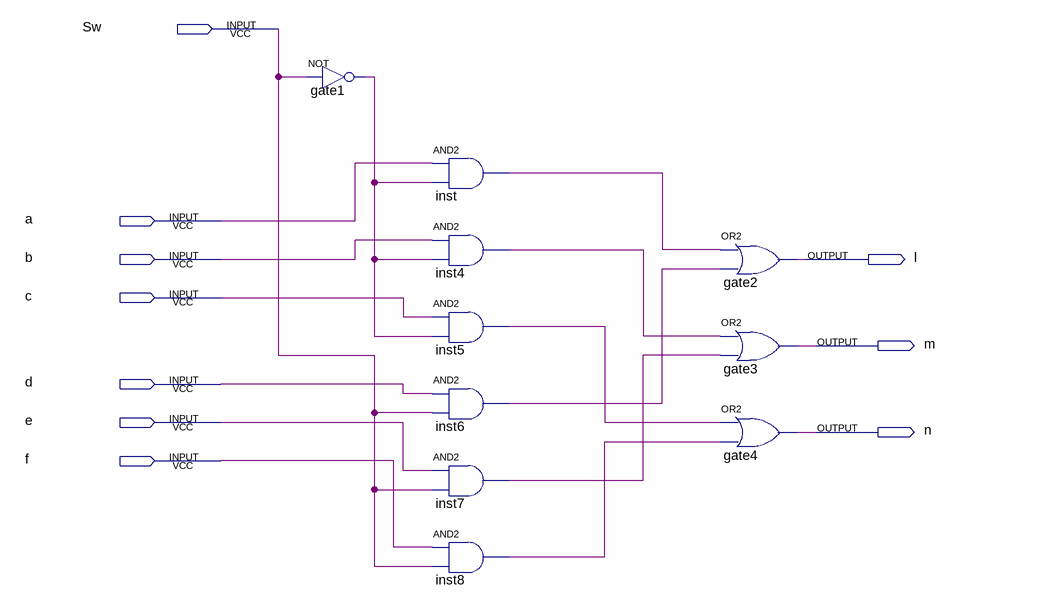
[diagram p0: schematic sheet]
// Quartus schematic 3x2-1mux.bdf as structural Verilog: 10 symbols, 10 pins
module \3x2-1mux  (
  input  Sw,
  input  a,
  input  b,
  input  c,
  input  d,
  input  e,
  input  f,
  output l,
  output m,
  output n
);

  wire gate1_out, inst4_out, inst5_out, inst6_out, inst7_out, inst8_out, inst_out;

  not gate1 (gate1_out, Sw);
  and inst (inst_out, a, gate1_out);
  and inst4 (inst4_out, b, gate1_out);
  and inst5 (inst5_out, c, gate1_out);
  and inst6 (inst6_out, d, Sw);
  and inst7 (inst7_out, e, Sw);
  and inst8 (inst8_out, f, Sw);
  or gate2 (l, inst_out, inst6_out);
  or gate3 (m, inst4_out, inst7_out);
  or gate4 (n, inst5_out, inst8_out);
endmodule
